# EAGLE design adapter (EAGLE 9.6.2)
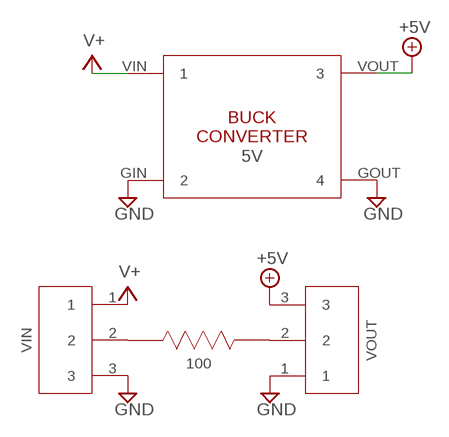
[diagram p0: schematic, sheet 1]

## Parts
U$1  5V  BUCK_CONVERTER  [BUCK_CONVERTER]
U$2  100  RESISTORTHROUGHHOLE  [RESISTOR_THROUGHHOLE]
VIN  J3PIN  [J3PIN]
VOUT  J3PIN  [J3PIN]

## Nets
+5V: U$1.VOUT VOUT.3
GND: U$1.GIN U$1.GOUT VIN.3 VOUT.1
N$1: U$2.1 VIN.2
N$2: U$2.2 VOUT.2
V+: U$1.VIN VIN.1

## Library data of the parts
U$1 = Mikes Library:BUCK_CONVERTER
U$2 = Mikes Library:RESISTOR
VIN VOUT = Mikes Library:J3PIN

## Board
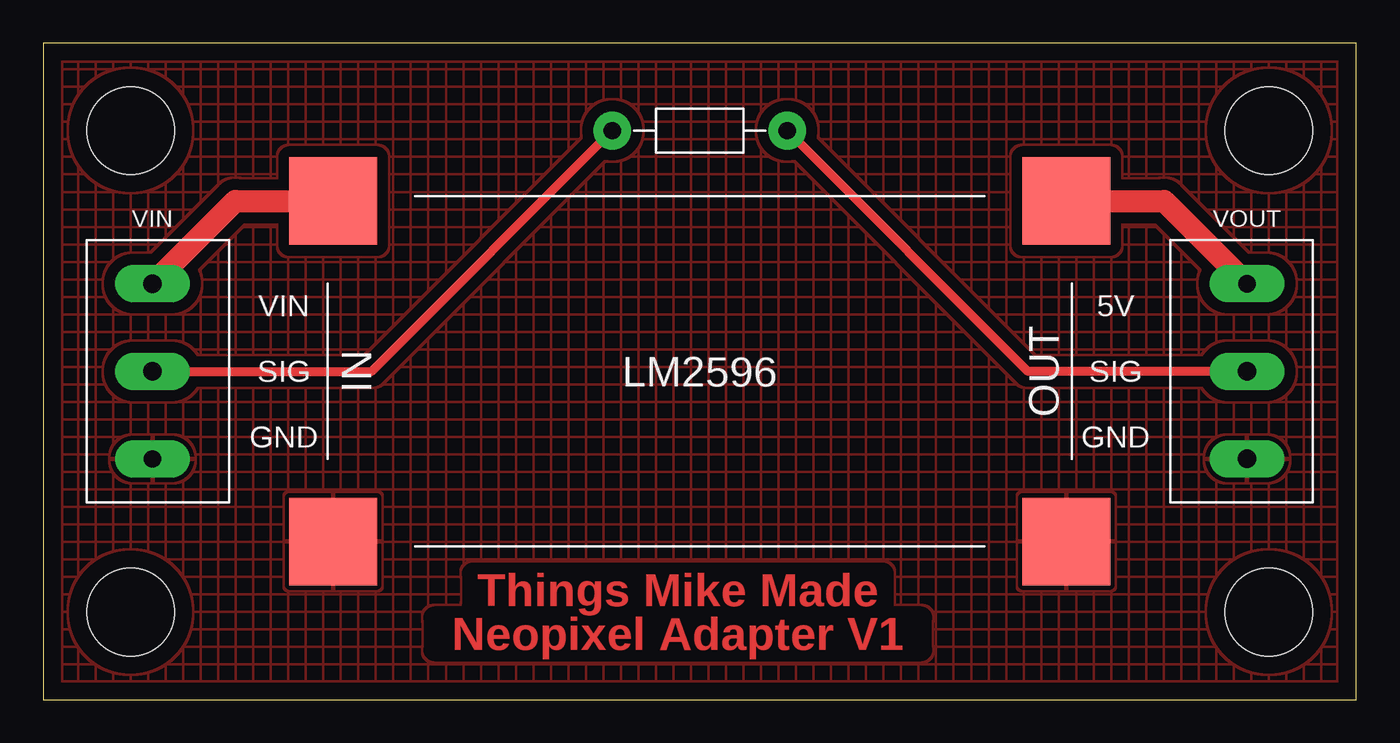
[diagram p1: board, top side]
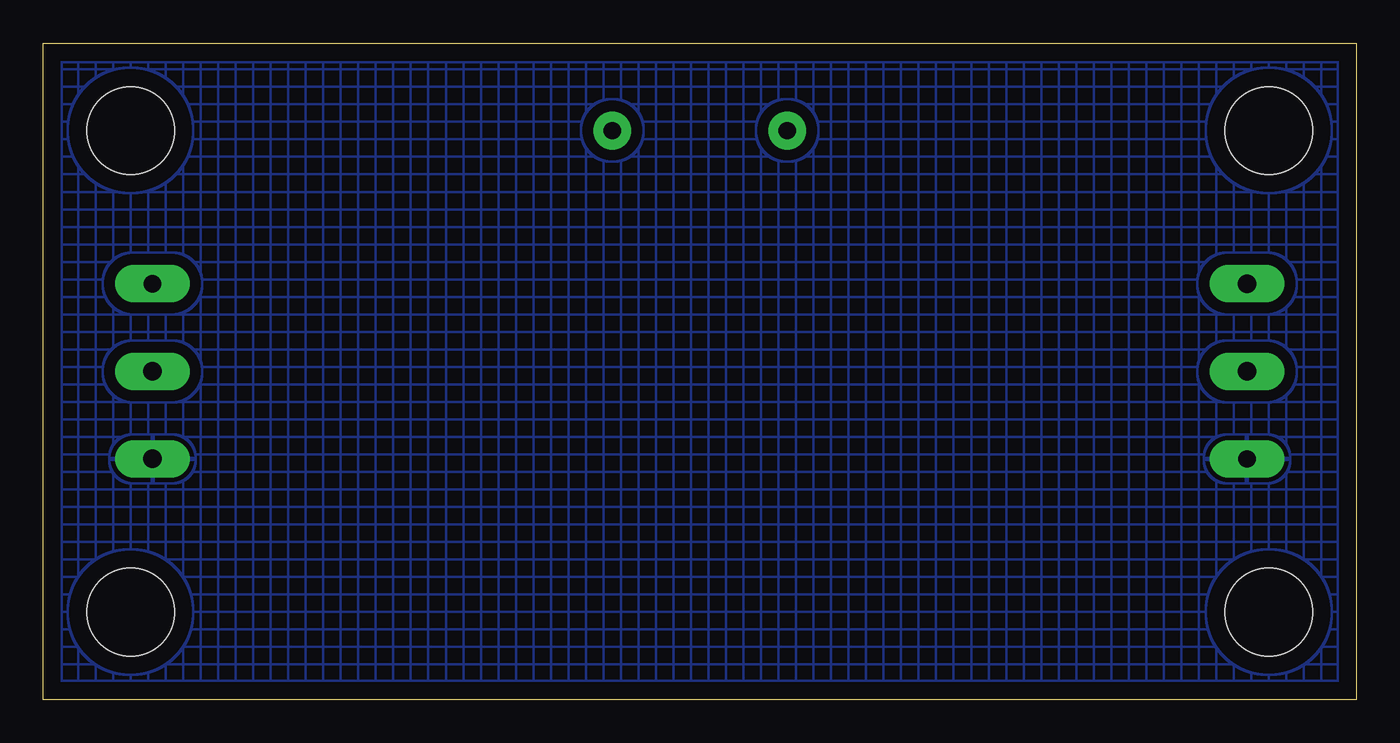
[diagram p2: board, bottom side, seen from below]

Size 76.2 x 38.1 mm. Coordinates in mm from the lower left corner, seen from the top.
Outline: 0,0 76.2,0 76.2,38.1 0,38.1 0,0
Copper layers (1*16): Top 0.035mm / dielectric 1.5mm / Bottom 0.035mm
Design rules "default": minimum track width 6mil, minimum drill 0.35mm, track to track 6mil, track to pad 6mil, pad to pad 6mil, via to via 6mil, smd to smd 6mil, copper to edge 40mil, drill to drill 6mil, minimum pad ring 10mil, minimum via ring 8mil, stop-mask expansion 4mil, vias tented up to drill 0mil, thermal gap 10mil
Holes 5.08 mm at 5.08,33.02 5.08,5.08 71.12,5.08 71.12,33.02

### Footprints (pad centres in the part's own frame; a part is rotated, then mirrored left to right if it is on the bottom)
BUCK_CONVERTER = smd 5.08 x 5.08: GIN -21.273,-9.881; GOUT 21.273,-9.881; VIN -21.273,9.881; VOUT 21.273,9.881
RESISTOR_THROUGHHOLE = drill 1 pad 2.184: 1 -5.08,0; 2 5.08,0
J3PIN = drill 1.079 pad 2.184 long: 1 0,-5.08; 2 0,0 | drill 1 pad 2.184 long: 3 0,5.08

### Placement (x,y rotation side)
U$1  38.1,19.05 0 top
U$2  38.1,33.02 0 top
VIN  6.35,19.05 180 top
VOUT  69.85,19.05 0 top

### Tracks (layer width: path | path; a pad name or v marks a point on that pad's centre or on a via)
+5V
  Top 1.27: U$1.VOUT 65.05,28.93 VOUT.3
GND
  pour Bottom (isolate 0.635, hatched): -2.54,40.64 -2.54,-2.54 78.74,-2.54 78.74,40.64
  pour Top (isolate 0.635, hatched): -1.27,39.37 -1.27,-1.27 77.47,-1.27 77.47,39.37
N$1
  Top 0.508: VIN.2 19.05,19.05 U$2.1
N$2
  Top 0.508: VOUT.2 57.15,19.05 U$2.2
V+
  Top 1.27: VIN.1 11.15,28.93 U$1.VIN

### Text on the board
Top: Things Mike Made | Neopixel Adapter V1
tPlace: VIN | 5V | SIG | SIG | GND | GND